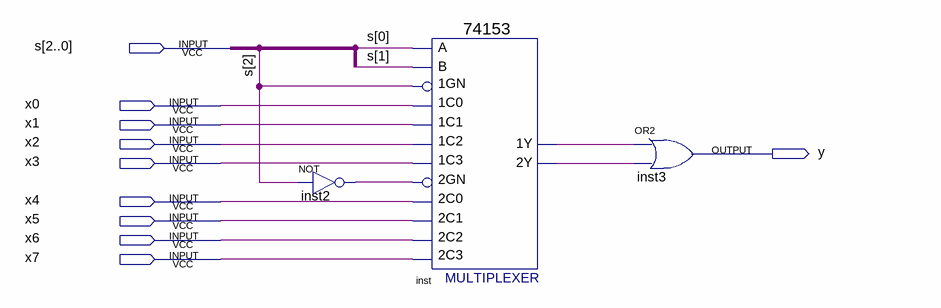
[diagram p0: schematic sheet]
// Quartus schematic teste2.bdf as structural Verilog: 3 symbols, 10 pins
module teste2 (
  input  [2:0] s,
  input  x0,
  input  x1,
  input  x2,
  input  x3,
  input  x4,
  input  x5,
  input  x6,
  input  x7,
  output y
);

  wire inst2_out, inst_1y, inst_2y;

  not inst2 (inst2_out, s[2]);
  \74153  inst (
    .\1C1 (x1), .\1GN (s[2]), .\1C0 (x0), .\2C0 (x4), .\2GN (inst2_out), .\2C2 (x6), .\1C2 (x2), .\1C3 (x3),
    .B(s[1]), .A(s[0]), .\2C1 (x5), .\2C3 (x7), .\1Y (inst_1y), .\2Y (inst_2y));
  or inst3 (y, inst_1y, inst_2y);
endmodule
